# Altium schematic sheet Buck converter 19-20.SchDoc
size A
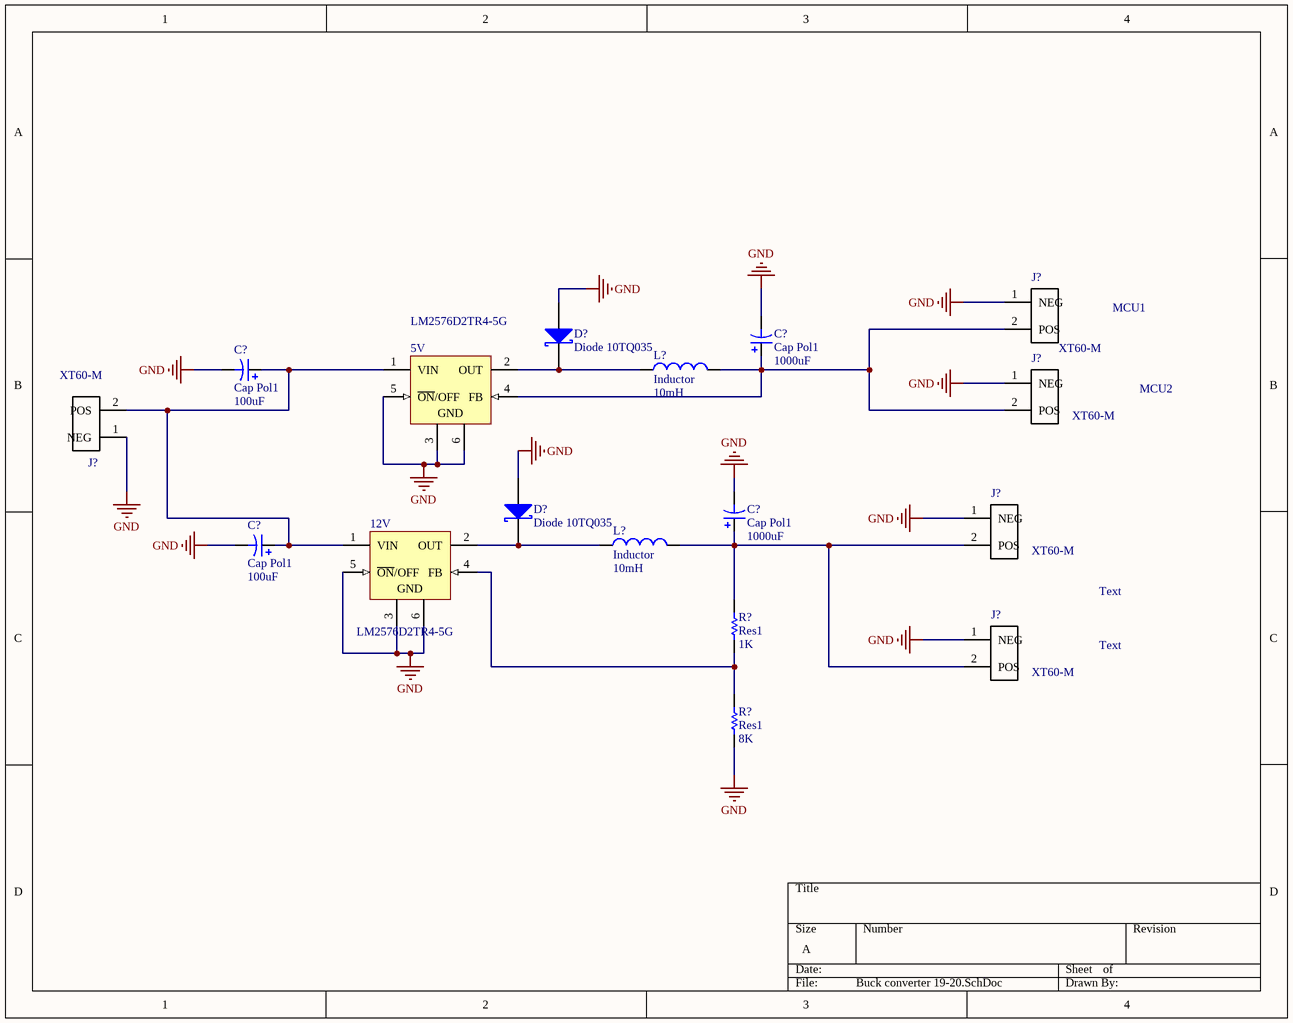
[diagram p0: Buck converter 19-20.SchDoc]

## Parts
(Parts that share a designator on the sheet are numbered #1, #2 ... from top to bottom, then left to right.)
5V  LM2576D2TR4-5G  [ONSC-D2PAK-5-936A-02_V]
12V  LM2576D2TR4-5G  [ONSC-D2PAK-5-936A-02_V]
C?#1  Cap Pol1  value 1000uF  [RB7.6-15]
C?#2  Cap Pol1  value 100uF  [RB7.6-15]
C?#3  Cap Pol1  value 1000uF  [RB7.6-15]
C?#4  Cap Pol1  value 100uF  [RB7.6-15]
D?#1  Diode 10TQ035  [TO-220AC]
D?#2  Diode 10TQ035  [TO-220AC]
J?#1  XT60-M  [*AMASS_XT60-M]
J?#2  XT60-M  [*AMASS_XT60-M]
J?#3  XT60-M  [*AMASS_XT60-M]
J?#4  XT60-M  [*AMASS_XT60-M]
J?#5  XT60-M  [*AMASS_XT60-M]
L?#1  Inductor  value 10mH  [0402-A]
L?#2  Inductor  value 10mH  [0402-A]
R?#1  Res1  value 1K  [AXIAL-0.3]
R?#2  Res1  value 8K  [AXIAL-0.3]

## Nets
GND: 5V.3(GND) 5V.5(~{ON}/OFF) 5V.6(GND) 12V.3(GND) 12V.5(~{ON}/OFF) 12V.6(GND) C?#1.2 C?#2.2 C?#3.2 C?#4.2 D?#1.3(A) D?#2.3(A) J?#1.1(NEG) J?#2.1(NEG) J?#3.1(NEG) J?#4.1(NEG) J?#5.1(NEG) R?#2.1
Net5V_1: 5V.1(VIN) 12V.1(VIN) C?#2.1 C?#4.1 J?#3.2(POS)
Net5V_2: 5V.2(OUT) D?#1.1(K) L?#1.1
Net5V_4: 5V.4(FB) C?#1.1 J?#1.2(POS) J?#2.2(POS) L?#1.2
Net12V_2: 12V.2(OUT) D?#2.1(K) L?#2.1
Net12V_4: 12V.4(FB) R?#1.1 R?#2.2
NetC?#3_1: C?#3.1 J?#4.2(POS) J?#5.2(POS) L?#2.2 R?#1.2

## Notes on the sheet
- MCU1
- MCU2
- Text

## Library data of the parts
5V 12V = CMP-1679-00008-1: Step-Down Switching Regulator, 3 A, 5 V, -40 to 125 degC, 5-Pin D2PAK (936A-02), RoHS, Tape and Reel; Frequency Tolerance: 20ppm; Load Capacitance: 18 pF; ESR: 50 Ohm; Capacitance: 1.8E-11 f; Frequency: 24 MHz; Width: 0.126 inch; Length: 0.197 inch; Package Quantity: 1000; Case/Package: CSMD; ComponentLink2URL: http://www.onsemi.com/pub_link/Collateral/LM2576-D.PDF; PackageDescription: 5-Pin Transistor Outline, Body 10.02 x 9.1945 mm, Pitch 1.702 mm; Pins: 4; Min Operating Temperature: -20degC; Packaging: Tape and Reel; Mount: Surface Mount; ComponentLink1Description: Manufacturer URL; Tolerance: 20ppm; ComponentLink2Description: Datasheet; PackageReference: D2PAK-5-936A-02; RoHSCompliant: True; DatasheetVersion: Rev. 8, 01/2006; Height: 0.043 inch; Max Operating Temperature: 70degC; Resistance: 50 Ohm; ComponentLink1URL: http://www.onsemi.com/
C?#1-C?#4 = Cap Pol1: Polarized Capacitor (Radial); Published: 8-Jun-2000; LatestRevisionDate: 17-Jul-2002; LatestRevisionNote: Re-released for DXP Platform.; PackageReference: RB7.6-15; Publisher: Altium Limited; PackageDescription: Polarized Capacitor (Radial); 2 Leads
D?#1 D?#2 = Diode 10TQ035: Schottky Rectifier; Note: Terminal 2 is the TAB and is electrically connected to the cathode; Published: 8-Jun-2000; LatestRevisionDate: 17-Jul-2002; LatestRevisionNote: Re-released for DXP Platform.; DatasheetVersion: PD-2.057B; PackageVersion: Feb-1998; PackageReference: TO-220AC; Publisher: Altium Limited; PackageDescription: TO, Thru-Hole, Vertical, Heatsink Mounted; 3 In-Line Leads (1 Absent); Pitch 2.54 mm; ComponentLink1Description: Manufacturer Link; ComponentLink1URL: http://www.irf.com/; ComponentLink2Description: Datasheet; ComponentLink2URL: http://www.irf.com/product-info/datasheets/data/10tq.pdf
J?#1-J?#5 = XT60-M: MF: AMASS; Availability: Unavailable; Price: None; MP: XT60-M; Package: Package Analog Devices; SnapEDA_Link: https://www.snapeda.com/parts/XT60-M/AMASS/view-part/?ref=snap; Value: *
L?#1 L?#2 = Inductor: Code_IEC: 1005; Published: 8-Jun-2000; LatestRevisionDate: 29-May-2009; LatestRevisionNote: IPC-7351 Footprint Added.; PackageReference: 0402-A; Publisher: Altium Limited; PackageDescription: Chip Inductor; Code_JEITA: 0402
R?#1 R?#2 = Res1: Resistor; Published: 8-Jun-2000; LatestRevisionDate: 17-Jul-2002; LatestRevisionNote: Re-released for DXP Platform.; PackageReference: AXIAL-0.3; Publisher: Altium Limited; PackageDescription: Axial Device, Thru-Hole; 2 Leads; 0.3 in Pin Spacing